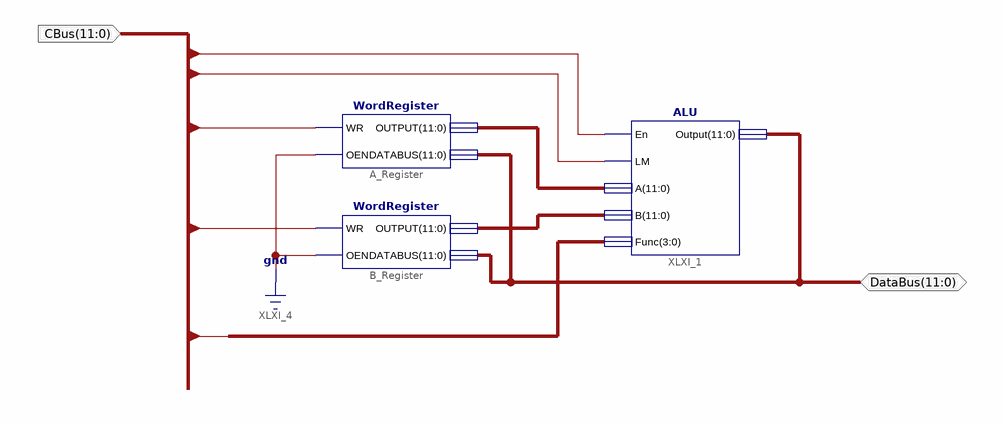
[diagram p0: schematic sheet 1]
// Xilinx ISE schematic BussedALU.sch (spartan3e) as structural Verilog: 3 symbols, 2 ports
module BussedALU (
  input  [11:0] CBus,
  inout  [11:0] DataBus
);

  wire [11:0] XLXN_4, XLXN_5;

  ALU XLXI_1 (.En(CBus[5]), .LM(CBus[4]), .A(XLXN_4), .B(XLXN_5), .Func(CBus[11:8]), .Output(DataBus));
  WordRegister A_Register (.WR(CBus[2]), .OEN(1'b0), .OUTPUT(XLXN_4), .DATABUS(DataBus));
  WordRegister B_Register (.WR(CBus[3]), .OEN(1'b0), .OUTPUT(XLXN_5), .DATABUS(DataBus));
endmodule
